# EAGLE design puente-h (EAGLE 5.06)
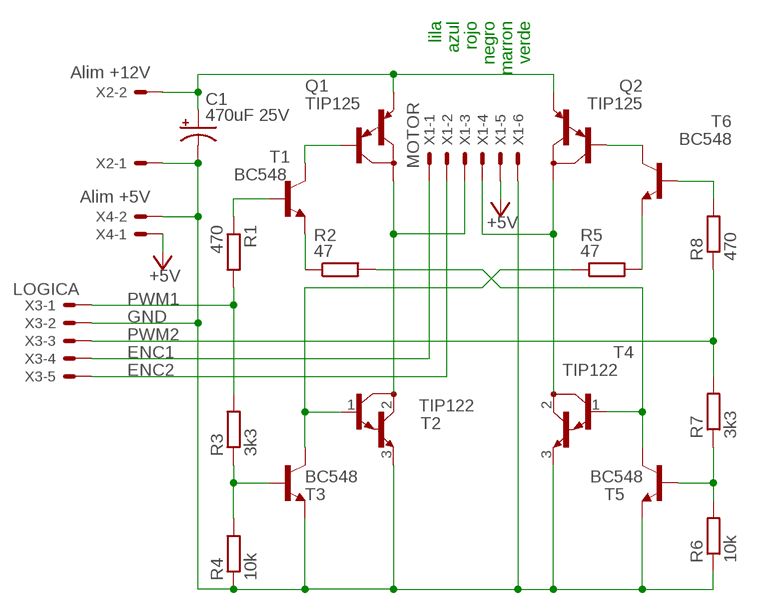
[diagram p0: schematic, sheet 1]

## Parts
C1  470uF 25V  CPOL-USE5-8.5  [E5-8,5]
Q1  TIP125  [TO220]
Q2  TIP125  [TO220]
R1  470  R-EU_0204/7  [0204/7]
R2  47  R-EU_0204/7  [0204/7]
R3  3k3  R-EU_0204/7  [0204/7]
R4  10k  R-EU_0204/7  [0204/7]
R5  47  R-EU_0204/7  [0204/7]
R6  10k  R-EU_0204/7  [0204/7]
R7  3k3  R-EU_0204/7  [0204/7]
R8  470  R-EU_0204/7  [0204/7]
T1  BC548  [TO92-EBC]
T2  TIP122  [TO220]
T3  BC548  [TO92-EBC]
T4  TIP122  [TO220]
T5  BC548  [TO92-EBC]
T6  BC548  [TO92-EBC]
X1  MOTOR  C-GRID-06-70543  [70543-06]
X2  Alim +12V  C-GRID-02-70543  [70543-02]
X3  LOGICA  C-GRID-05-70543  [70543-05]
X4  Alim +5V  C-GRID-02-70543  [70543-02]

## Nets
+5V: X1.5 X4.1
ENC1: X1.1 X3.4
ENC2: X1.2 X3.5
GND: C1.- R4.1 R6.1 T2.3(E) T3.E T4.3(E) T5.E X1.6 X2.1 X3.2 X4.2
N$1: R1.1 T1.B
N$2: Q1.1(B) T1.C
N$3: R2.1 T1.E
N$4: Q1.2(C) T2.2(C) X1.3
N$5: R5.1 T2.1(B) T3.C
N$7: R3.1 R4.2 T3.B
N$9: R6.2 R7.1 T5.B
N$11: Q2.2(C) T4.2(C) X1.4
N$12: R2.2 T4.1(B) T5.C
N$13: R5.2 T6.E
N$14: Q2.1(B) T6.C
N$15: R8.2 T6.B
N$17: C1.+ Q1.3(E) Q2.3(E) X2.2
PWM1: R1.2 R3.2 X3.1
PWM2: R7.2 R8.1 X3.3

## Notes on the sheet
- lila | azul | rojo | negro | marron | verde

## Library data of the parts
C1 = rcl:CPOL-US: POLARIZED CAPACITOR, American symbol
Q1 Q2 = transistor-pnp:TIP125: PNP Transistor
R1-R8 = resistor:R-EU_: RESISTOR, European symbol
T1 T3 T5 T6 = transistor-npn:BC548*: NPN Transistor
T2 T4 = transistor:TIP122: NPN BIPOLAR DARLINGTON TRANSISTOR
X1 = con-molex:C-GRID-06: CONNECTOR wire to board 2.54 mm (0.100") pitch header
X2 X4 = con-molex:C-GRID-02: CONNECTOR wire to board 2.54 mm (0.100") pitch header
X3 = con-molex:C-GRID-05: CONNECTOR wire to board 2.54 mm (0.100") pitch header

## Board
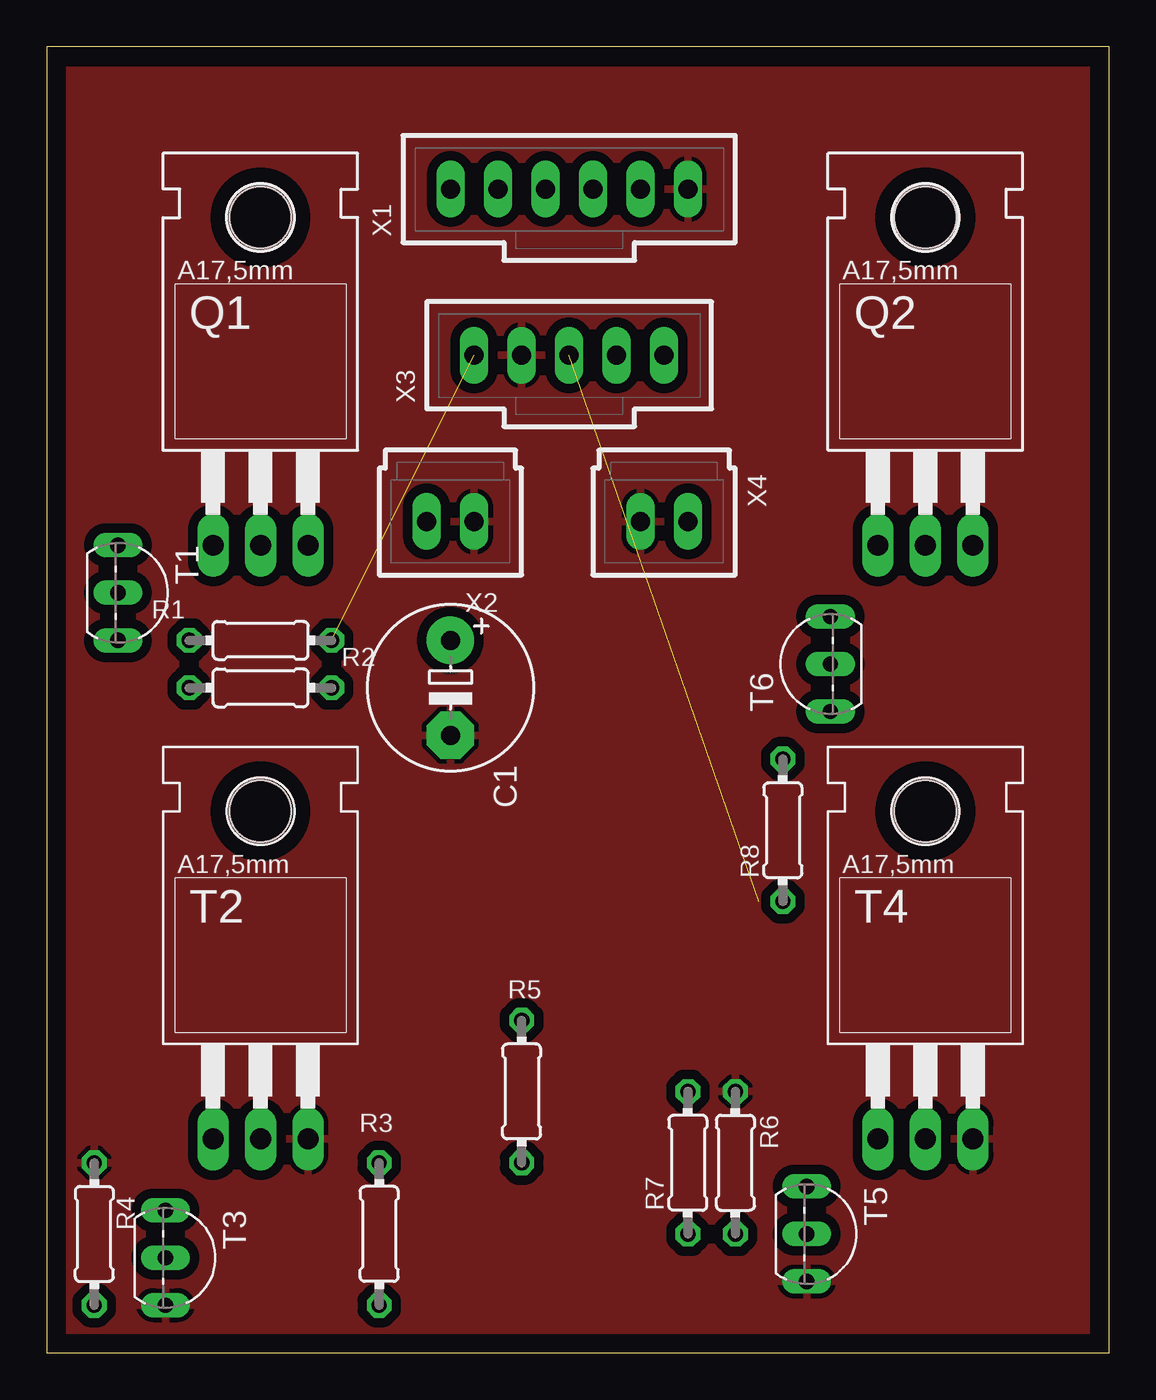
[diagram p1: board, top side]
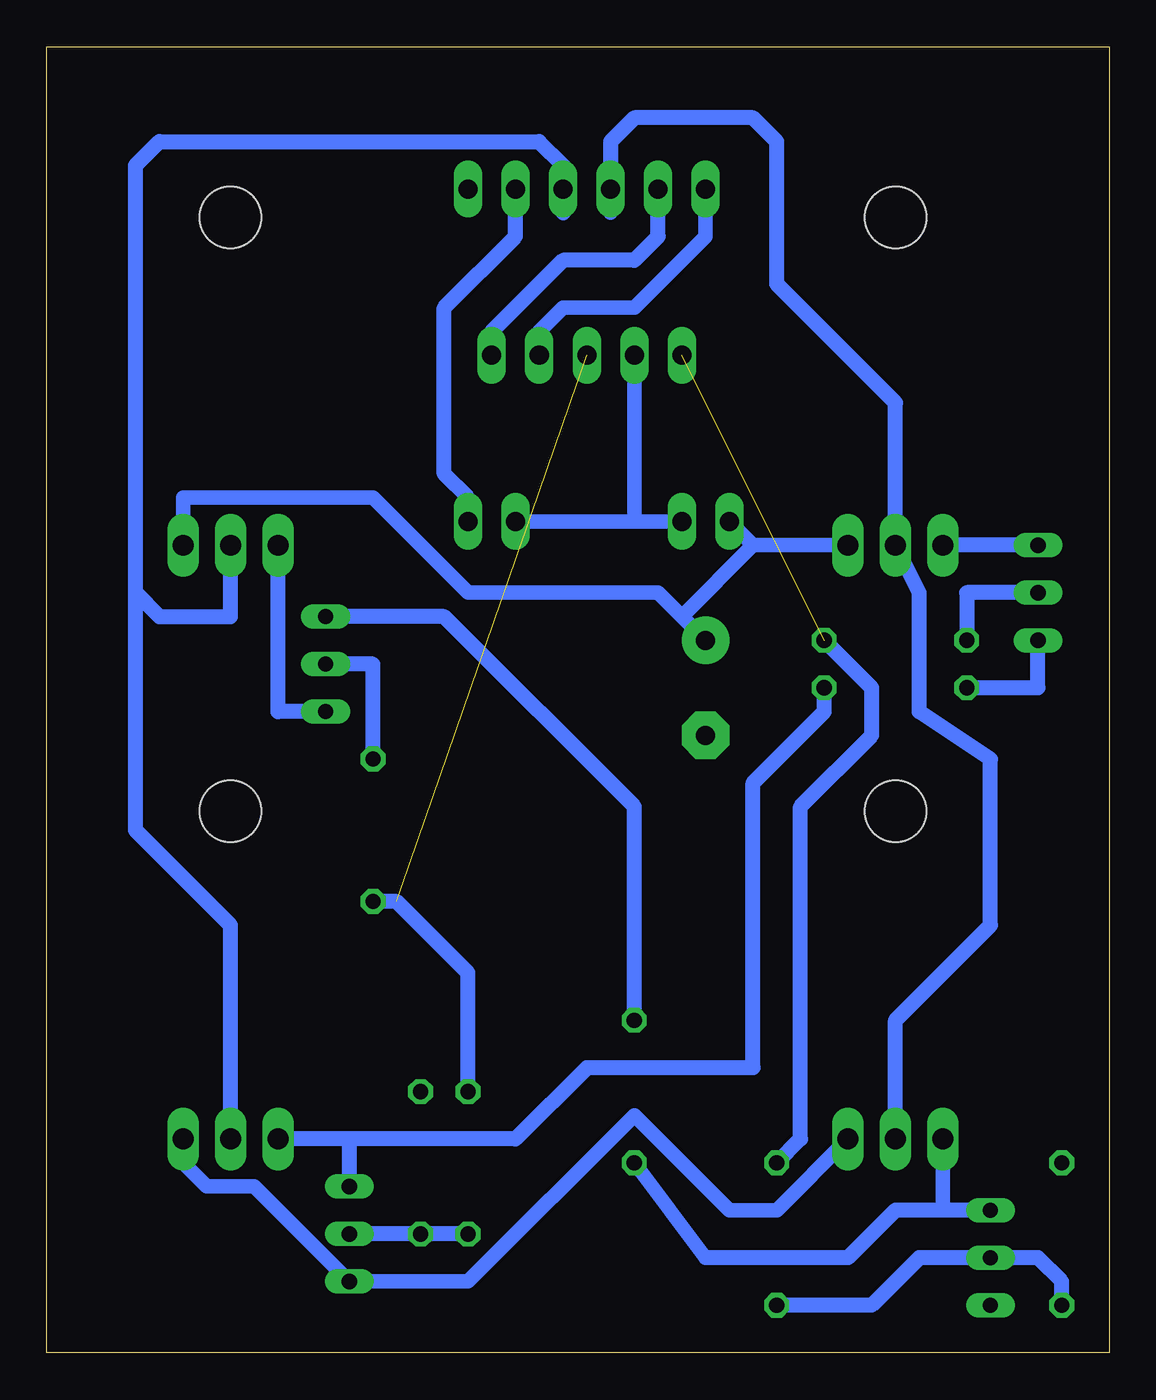
[diagram p2: board, bottom side, seen from below]

Size 56.82 x 69.84 mm. Coordinates in mm from the lower left corner, seen from the top.
Outline: 0,0 56.82,0 56.82,69.84 0,69.84 0,0
Copper layers (1*16): Top 0.035mm / dielectric 1.5mm / Bottom 0.035mm
Design rules "default *": minimum track width 30mil, minimum drill 24mil, track to track 20mil, track to pad 8mil, pad to pad 8mil, via to via 8mil, smd to smd 8mil, copper to edge 40mil, drill to drill 8mil, minimum pad ring 10mil, minimum via ring 8mil, stop-mask expansion 4mil, vias tented up to drill 0mil, thermal gap 10mil

### Footprints (pad centres in the part's own frame; a part is rotated, then mirrored left to right if it is on the bottom)
E5-8,5 = drill 1.016 pad 2.54 round: + -2.54,0 | drill 1.016 pad 2.54 octagon: - 2.54,0
TO220 = drill 1.118 long: 1 -2.54,-6.35; 2 0,-6.35; 3 2.54,-6.35 | hole 3.302: 0,11.176
0204/7 = drill 0.813 octagon: 1 -3.81,0; 2 3.81,0
TO92-EBC = drill 0.813 long: B 0,-1.27; C -2.54,-1.27; E 2.54,-1.27
70543-06 = drill 1.016 long: 1 -6.35,0; 2 -3.81,0; 3 -1.27,0; 4 1.27,0; 5 3.81,0; 6 6.35,0
70543-02 = drill 1.016 long: 1 -1.27,0; 2 1.27,0
70543-05 = drill 1.016 long: 1 -5.08,0; 2 -2.54,0; 3 0,0; 4 2.54,0; 5 5.08,0

### Placement (x,y rotation side)
C1  21.59,35.56 270 top
Q1  11.43,49.53 0 top
Q2  46.99,49.53 0 top
R1  11.43,38.1 0 top
R2  11.43,35.56 0 top
R3  17.78,6.35 90 top
R4  2.54,6.35 270 top
R5  25.4,13.97 90 top
R6  36.83,10.16 270 top
R7  34.29,10.16 90 top
R8  39.37,27.94 90 top
T1  5.08,40.64 270 top
T2  11.43,17.78 0 top
T3  7.62,5.08 270 top
T4  46.99,17.78 0 top
T5  41.91,6.35 270 top
T6  40.64,36.83 90 top
X1  27.94,62.23 0 top
X2  21.59,44.45 180 top
X3  27.94,53.34 0 top
X4  33.02,44.45 180 top

### Tracks (layer width: path | path; a pad name or v marks a point on that pad's centre or on a via)
+5V
  Bottom 0.813: X4.1 34.29,45.72 35.56,46.99 35.56,55.88 31.75,59.69 X1.5
ENC1
  Bottom 0.762: X3.4 30.48,54.61 29.21,55.88 25.4,55.88 21.59,59.69 X1.1
ENC2
  Bottom 0.813: X3.5 33.02,54.61 29.21,58.42 25.4,58.42 24.13,59.69 X1.2
GND
  Bottom 0.762: T4.3 49.53,10.16 48.26,8.89 45.72,8.89 T5.E 34.29,3.81 25.4,12.7 20.32,7.62 17.78,7.62 T2.3 | 25.4,44.45 X4.2 | X2.1 25.4,44.45 | 25.4,44.45 X3.2
  pour Top: -1.27,68.58 59.69,68.58 59.69,-2.54 -1.27,-2.54
N$1
  Bottom 0.813: R1.1 7.62,40.64 T1.B
N$2
  Bottom 0.813: T1.C Q1.1
N$3
  Bottom 0.813: R2.1 3.81,35.56 T1.E
N$4
  Bottom 0.762: X1.3 26.67,60.96
  Bottom 0.813: 26.67,63.5 X1.3 26.67,64.77 25.4,66.04 19.05,66.04 17.78,64.77 17.78,57.15 11.43,50.8 Q1.2 10.16,40.64 10.16,34.29 6.35,31.75 6.35,22.86 11.43,17.78 T2.2
N$5
  Bottom 0.762: 8.89,7.62 T2.1 | 21.59,5.08 R5.1
  Bottom 0.813: T3.C 8.89,7.62 11.43,7.62 13.97,5.08 21.59,5.08
N$7
  Bottom 0.813: R3.1 12.7,2.54 10.16,5.08 T3.B 3.81,5.08 2.54,3.81 R4.2
N$9
  Bottom 0.813: R7.1 R6.2 T5.B
N$11
  Bottom 0.813: Q2.2 46.99,39.37 50.8,39.37 52.07,40.64 | 29.21,60.96 X1.4 29.21,63.5 30.48,64.77 50.8,64.77 52.07,63.5 52.07,40.64 | T4.2 46.99,22.86 52.07,27.94 52.07,40.64
N$12
  Bottom 0.813: R2.2 15.24,34.29 19.05,30.48 19.05,15.24 27.94,15.24 31.75,11.43 40.64,11.43 | 40.64,11.43 T4.1 | 40.64,11.43 T5.C
N$13
  Bottom 0.813: R5.2 25.4,29.21 35.56,39.37 T6.E
N$14
  Bottom 0.813: T6.C 44.45,34.29 Q2.1
N$15
  Bottom 0.813: T6.B 39.37,36.83 R8.2
N$17
  Bottom 0.762: 19.05,43.18 X2.2 | Q1.3 19.05,43.18 | Q2.3 49.53,45.72 39.37,45.72 34.29,40.64 24.13,40.64 22.86,39.37 | 22.86,39.37 C1.+ | 19.05,43.18 22.86,39.37
PWM1  (1 unrouted)
  Bottom 0.813: R3.2 16.51,11.43 16.51,29.21 12.7,33.02 12.7,35.56 R1.2
PWM2  (1 unrouted)
  Bottom 0.813: R8.1 38.1,24.13 34.29,20.32 R7.2